# Altium schematic sheet Heater.SchDoc
size A4
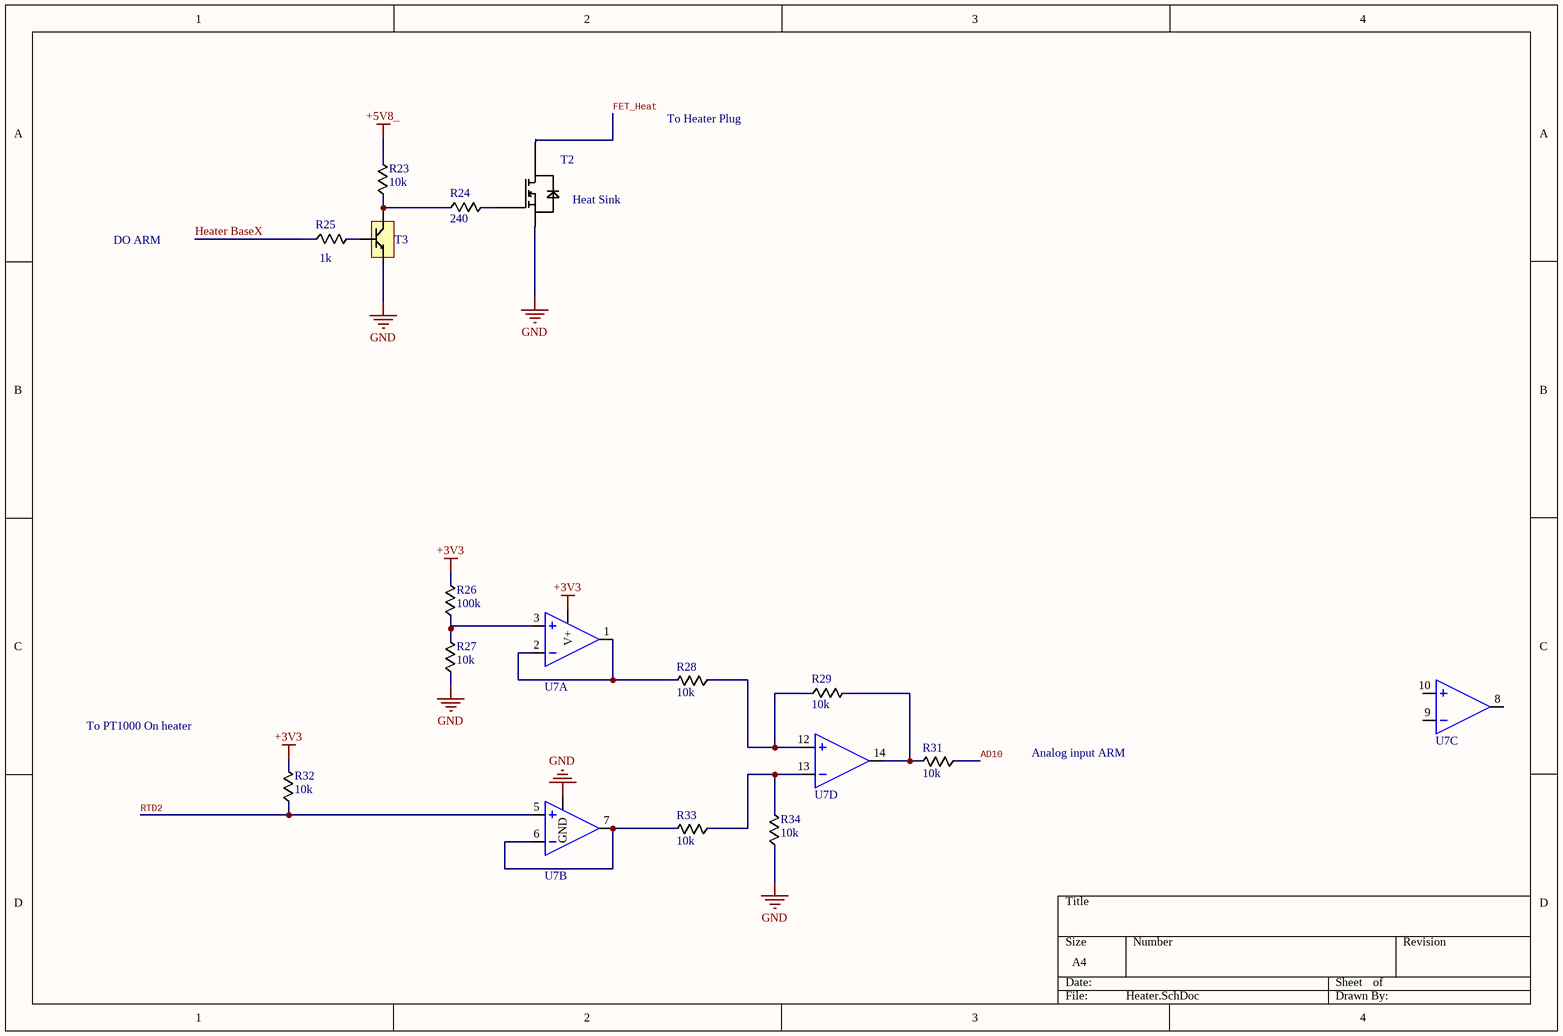
[diagram p0: Heater.SchDoc]

## Parts
R23  10k  [0603]
R24  240  [0603]
R25  1k  [0603]
R26  100k  [0603]
R27  10k  [0603]
R28  10k  [0603]
R29  10k  [0603]
R31  10k  [0603]
R32  10k  [0603]
R33  10k  [0603]
R34  10k  [0603]
T2  IRFL024Npbf  [SOT223]  (value not drawn)
T3  mmbt3904  [SOT23]  (value not drawn)
U7  LM324DT  [SOIC 14 lead]  (value not drawn)  (parts A,B,C,D of 4)

## Nets
+3V3: R26.2 R32.2 U7.4(V+)
+5V8_: R23.2
GND: R27.1 R34.1 T2.3(S) T3.2 U7.11(GND)
AD10: R31.1
FET_Heat: T2.2(D)
Heater BaseX: R25.1
RTD2: R32.1 U7.5(+IN)
NetR23_1: R23.1 R24.1 T3.3
NetR24_2: R24.2 T2.1(G)
NetR25_2: R25.2 T3.1
NetR26_1: R26.1 R27.2 U7.3(+IN)
NetR28_1: R28.1 R29.1 U7.12(+IN)
NetR28_2: R28.2 U7.1(OUT) U7.2(-IN)
NetR29_2: R29.2 R31.2 U7.14(OUT)
NetR33_1: R33.1 R34.2 U7.13(-IN)
NetR33_2: R33.2 U7.6(-IN) U7.7(OUT)

Not connected (* = marked no-connect by the designer): U7 8(OUT) 9(-IN) 10(+IN)

## Notes on the sheet
- To Heater Plug
- DO ARM
- (near T2) Heat Sink
- To PT1000 On heater
- Analog input ARM

## Library data of the parts
R23-R29 R31-R34 = Resistor 0805: RC0603FR-078K2
U7 = MCP609: OPAMP